# EAGLE schematic IC4KL_due_cont (EAGLE 9.6.1)
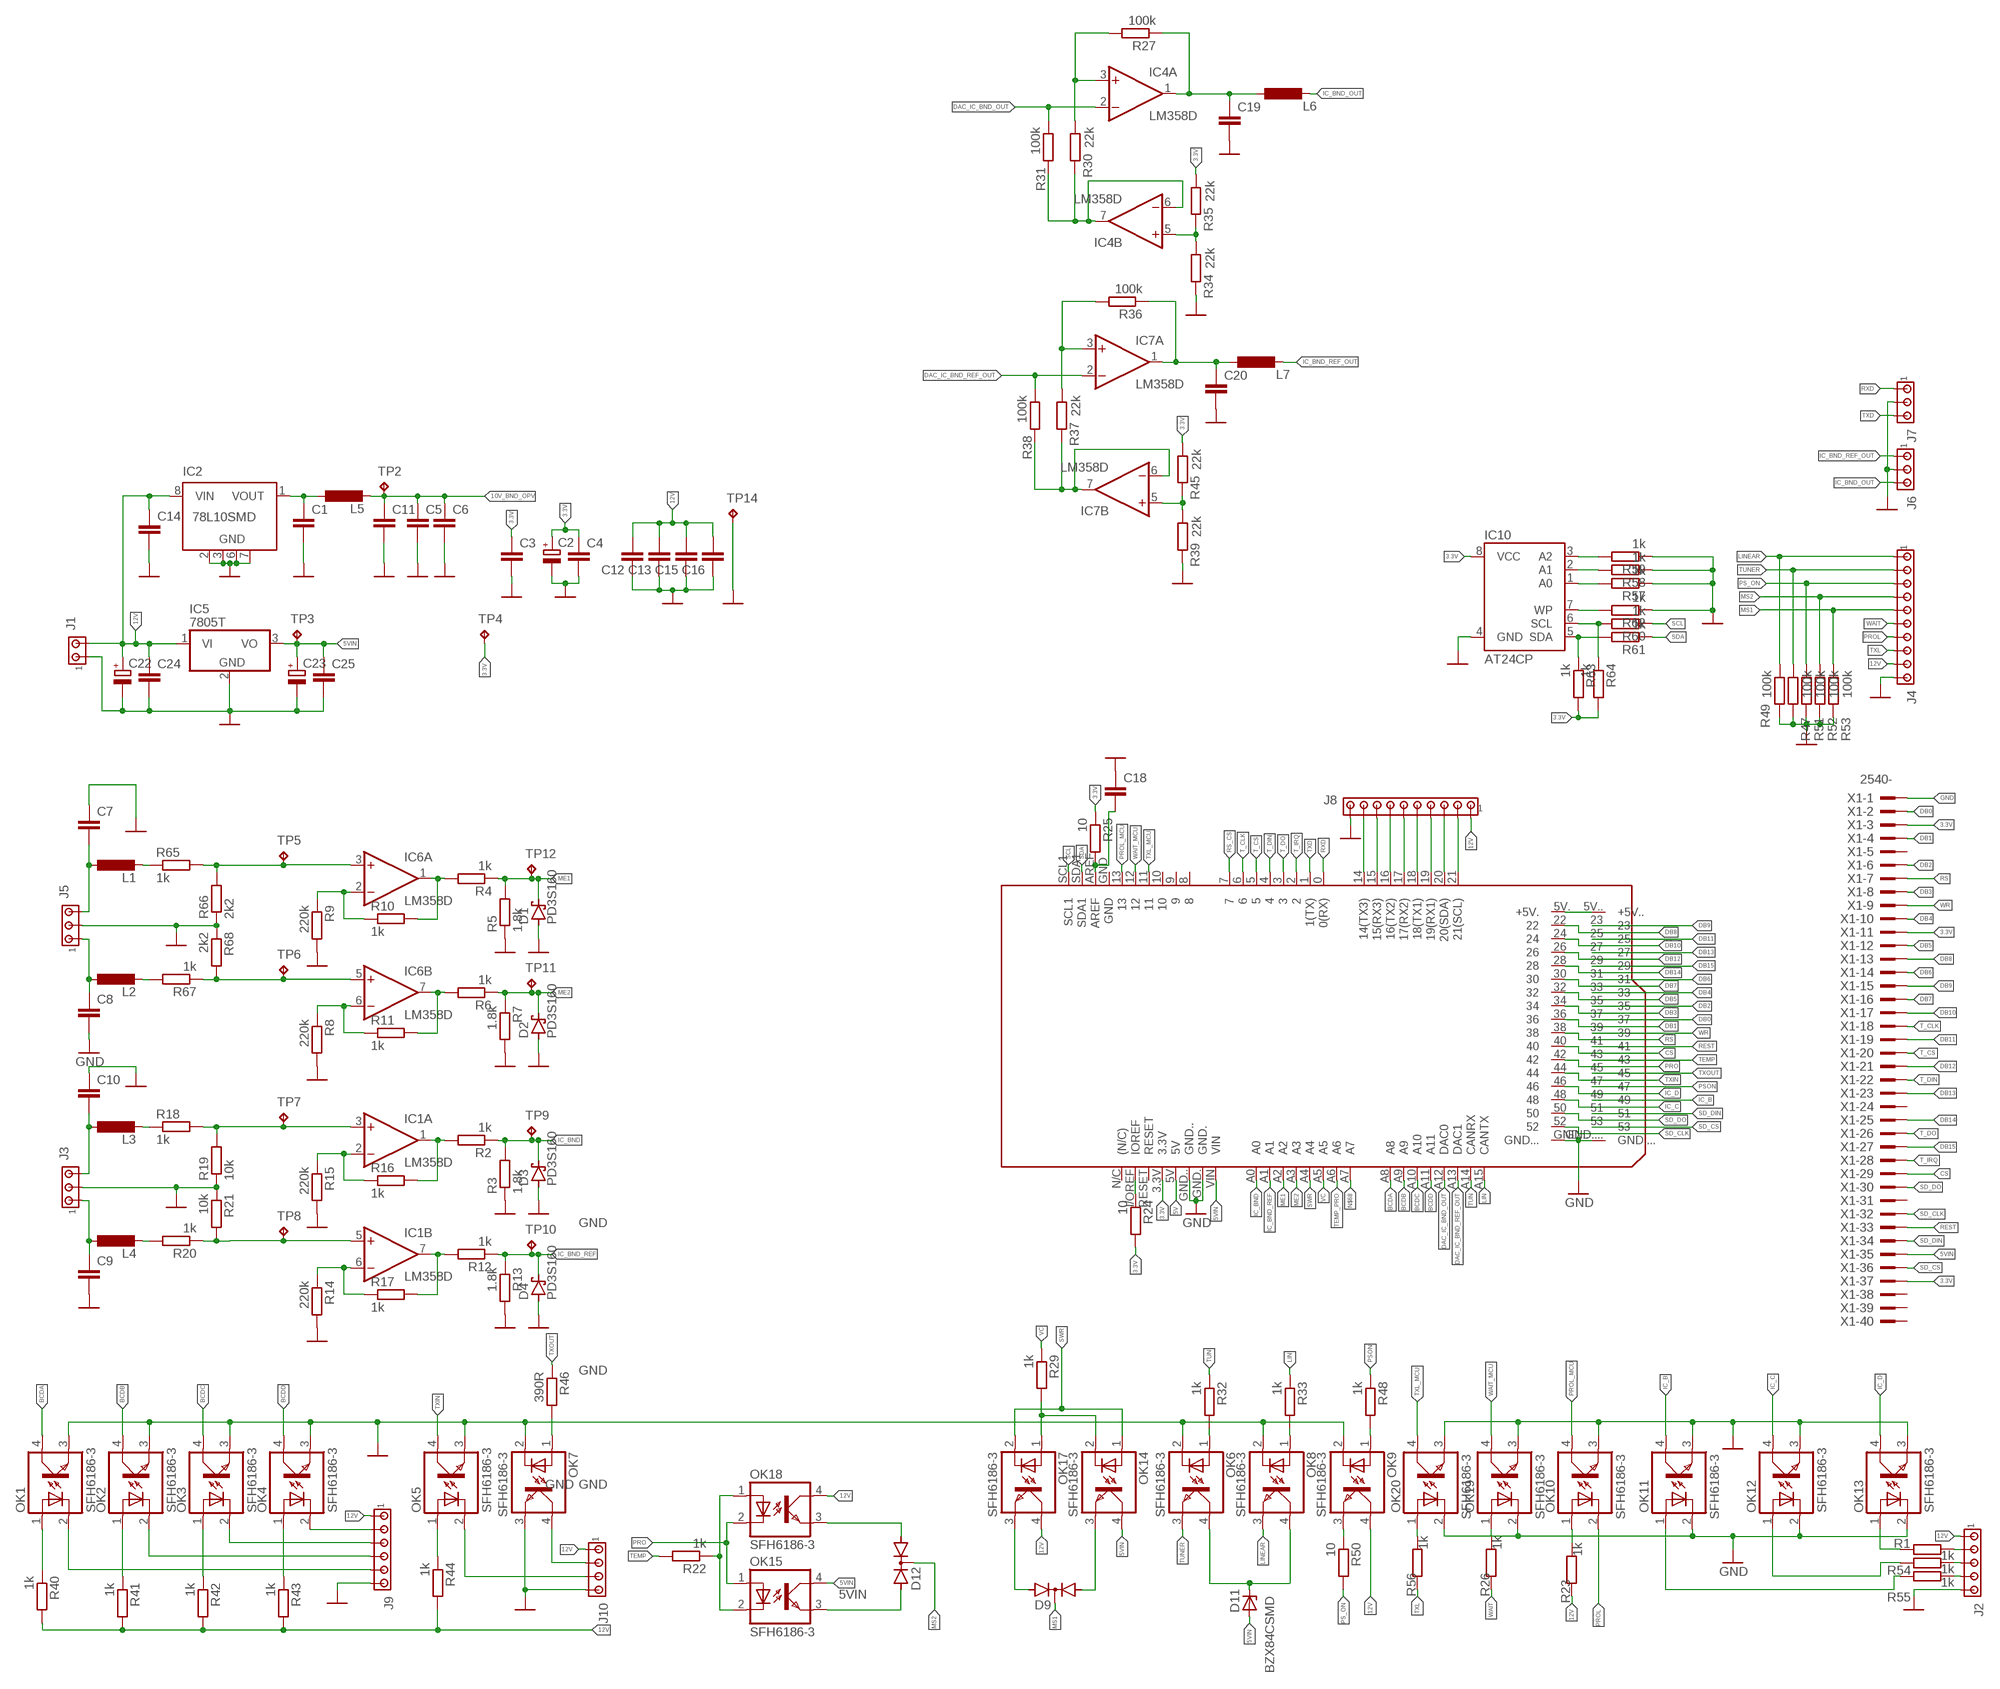
[diagram p0: schematic, sheet 1]

## Parts
C1  1u  C-EUC0805K  [C0805K]
C2  CPOL-EU085CS-1AW  [085CS_1AW]
C3  C-EUC0805K  [C0805K]
C4  C-EUC0805K  [C0805K]
C5  1u  C-EUC0805K  [C0805K]
C6  1u  C-EUC0805K  [C0805K]
C7  100n  C-EUC0805K  [C0805K]
C8  100n  C-EUC0805K  [C0805K]
C9  C-EUC0805K  [C0805K]
C10  C-EUC0805K  [C0805K]
C11  1u  C-EUC0805K  [C0805K]
C12  100n  C-EUC0805K  [C0805K]
C13  100n  C-EUC0805K  [C0805K]
C14  1u  C-EUC0805K  [C0805K]
C15  100n  C-EUC0805K  [C0805K]
C16  100n  C-EUC0805K  [C0805K]
C18  C-EUC0805K  [C0805K]
C19  C-EUC0805K  [C0805K]
C20  C-EUC0805K  [C0805K]
C22  CPOL-EU150CLZ-1010  [150CLZ-1010]
C23  CPOL-EU150CLZ-1010  [150CLZ-1010]
C24  C-EUC0805K  [C0805K]
C25  C-EUC0805K  [C0805K]
D1  PD3S160  [POWERDI323]
D2  PD3S160  [POWERDI323]
D3  PD3S160  [POWERDI323]
D4  PD3S160  [POWERDI323]
D9  DIODE-2AC|CASOT23  [SOT23]
D11  BZX84CSMD  [TO236]
D12  DIODE-2AC|CASOT23  [SOT23]
IC1  LM358D  [SO08]
IC2  78L10SMD  78L08SMD  [SO08]
IC4  LM358D  [SO08]
IC5  7805T  [TO220H]
IC6  LM358D  [SO08]
IC7  LM358D  [SO08]
IC10  AT24CP  [DIL08]
J1  MTA02-100  [10X02MTA]
J2  MTA05-100  [10X05MTA]
J3  MTA03-100  [10X03MTA]
J4  MTA10-100  [10X10MTA]
J5  MTA03-100  [10X03MTA]
J6  MTA03-100  [10X03MTA]
J7  MTA03-100  [10X03MTA]
J8  MTA10-100  [10X10MTA]
J9  MTA06-100  [10X06MTA]
J10  MTA04-100  [10X04MTA]
L1  L-EUL2012C  [L2012C]
L2  L-EUL2012C  [L2012C]
L3  L-EUL2012C  [L2012C]
L4  L-EUL2012C  [L2012C]
L5  L-EUL2012C  [L2012C]
L6  L-EUL2012C  [L2012C]
L7  L-EUL2012C  [L2012C]
OK1  SFH6186-3  [SMD4]
OK2  SFH6186-3  [SMD4]
OK3  SFH6186-3  [SMD4]
OK4  SFH6186-3  [SMD4]
OK5  SFH6186-3  [SMD4]
OK6  SFH6186-3  [SMD4]
OK7  SFH6186-3  [SMD4]
OK8  SFH6186-3  [SMD4]
OK9  SFH6186-3  [SMD4]
OK10  SFH6186-3  [SMD4]
OK11  SFH6186-3  [SMD4]
OK12  SFH6186-3  [SMD4]
OK13  SFH6186-3  [SMD4]
OK14  SFH6186-3  [SMD4]
OK15  SFH6186-3  [SMD4]
OK17  SFH6186-3  [SMD4]
OK18  SFH6186-3  [SMD4]
OK19  SFH6186-3  [SMD4]
OK20  SFH6186-3  [SMD4]
PCB1  ARDUINO_DUE  [ARDUINO_DUE]
R1  1k  R-EU_R0805  [R0805]
R2  1k  R-EU_R0805  [R0805]
R3  1.8k  R-EU_R0805  [R0805]
R4  1k  R-EU_R0805  [R0805]
R5  1.8k  R-EU_R0805  [R0805]
R6  1k  R-EU_R0805  [R0805]
R7  1.8k  R-EU_R0805  [R0805]
R8  220k  R-EU_R0805  [R0805]
R9  220k  R-EU_R0805  [R0805]
R10  1k  R-EU_R0805  [R0805]
R11  1k  R-EU_R0805  [R0805]
R12  1k  R-EU_R0805  [R0805]
R13  1.8k  R-EU_R0805  [R0805]
R14  220k  R-EU_R0805  [R0805]
R15  220k  R-EU_R0805  [R0805]
R16  1k  R-EU_R0805  [R0805]
R17  1k  R-EU_R0805  [R0805]
R18  1k  R-EU_R0805  [R0805]
R19  10k  R-EU_R0805  [R0805]
R20  1k  R-EU_R0805  [R0805]
R21  10k  R-EU_R0805  [R0805]
R22  1k  R-EU_R0805  [R0805]
R23  1k  R-EU_R0805  [R0805]
R24  10  R-EU_R0805  [R0805]
R25  10  R-EU_R0805  [R0805]
R26  1k  R-EU_R0805  [R0805]
R27  100k  R-EU_R0805  [R0805]
R29  1k  R-EU_R0805  [R0805]
R30  22k  R-EU_R0805  [R0805]
R31  100k  R-EU_R0805  [R0805]
R32  1k  R-EU_R0805  [R0805]
R33  1k  R-EU_R0805  [R0805]
R34  22k  R-EU_R0805  [R0805]
R35  22k  R-EU_R0805  [R0805]
R36  100k  R-EU_R0805  [R0805]
R37  22k  R-EU_R0805  [R0805]
R38  100k  R-EU_R0805  [R0805]
R39  22k  R-EU_R0805  [R0805]
R40  1k  R-EU_R0805  [R0805]
R41  1k  R-EU_R0805  [R0805]
R42  1k  R-EU_R0805  [R0805]
R43  1k  R-EU_R0805  [R0805]
R44  1k  R-EU_R0805  [R0805]
R45  22k  R-EU_R0805  [R0805]
R46  390R  R-EU_R0805  [R0805]
R47  100k  R-EU_R0805  [R0805]
R48  1k  R-EU_R0805  [R0805]
R49  100k  R-EU_R0805  [R0805]
R50  10  R-EU_R0805  [R0805]
R51  100k  R-EU_R0805  [R0805]
R52  100k  R-EU_R0805  [R0805]
R53  100k  R-EU_R0805  [R0805]
R54  1k  R-EU_R0805  [R0805]
R55  1k  R-EU_R0805  [R0805]
R56  1k  R-EU_R0805  [R0805]
R57  1k  R-EU_R0805  [R0805]
R58  1k  R-EU_R0805  [R0805]
R59  1k  R-EU_R0805  [R0805]
R60  1k  R-EU_R0805  [R0805]
R61  1k  R-EU_R0805  [R0805]
R62  1k  R-EU_R0805  [R0805]
R63  1k  R-EU_R0805  [R0805]
R64  1k  R-EU_R0805  [R0805]
R65  1k  R-EU_R0805  [R0805]
R66  2k2  R-EU_R0805  [R0805]
R67  1k  R-EU_R0805  [R0805]
R68  2k2  R-EU_R0805  [R0805]
TP2  TPB1,27  [B1,27]
TP3  TPB1,27  [B1,27]
TP4  TPB1,27  [B1,27]
TP5  TPB1,27  [B1,27]
TP6  TPB1,27  [B1,27]
TP7  TPB1,27  [B1,27]
TP8  TPB1,27  [B1,27]
TP9  TPB1,27  [B1,27]
TP10  TPB1,27  [B1,27]
TP11  TPB1,27  [B1,27]
TP12  TPB1,27  [B1,27]
TP14  TPB1,27  [B1,27]
X1  2540-  [PAK100/2500-40]

## Nets
3.3V: C2.+ C3.1 C4.1 IC10.8(VCC) PCB1.3.3V R24.2 R25.1 R35.1 R45.1 R63.2 R64.2 TP4.TP X1.3 X1.11 X1.37
5V: PCB1.5V
5VIN: C23.+ C25.1 D11.A IC5.3(VO) OK14.4(COL) OK15.4(COL) PCB1.VIN TP3.TP X1.35
10V_BND_OPV: C5.1 C6.1 C11.1 L5.2 TP2.TP
12V: C12.2 C13.2 C14.1 C15.2 C16.2 C22.+ C24.1 IC2.8(VIN) IC5.1(VI) J1.2 J2.1 J4.9 J8.1 J9.6 J10.1 OK9.4(COL) OK17.4(COL) OK18.4(COL) R23.1 R40.2 R41.2 R42.2 R43.2 R44.2
BCDA: OK1.4(COL) PCB1.A8
BCDB: OK2.4(COL) PCB1.A9
BCDC: OK3.4(COL) PCB1.A10
BCDD: OK4.4(COL) PCB1.A11
CS: PCB1.40 X1.29
DAC_IC_BND_OUT: IC4.2(A:-IN) PCB1.A12(DAC0) R31.1
DAC_IC_BND_REF_OUT: IC7.2(A:-IN) PCB1.A13(DAC1) R38.1
DB0: PCB1.37 X1.2
DB1: PCB1.36 X1.4
DB2: PCB1.35 X1.6
DB3: PCB1.34 X1.8
DB4: PCB1.33 X1.10
DB5: PCB1.32 X1.12
DB6: PCB1.31 X1.14
DB7: PCB1.30 X1.16
DB8: PCB1.22 X1.13
DB9: PCB1.23 X1.15
DB10: PCB1.24 X1.17
DB11: PCB1.25 X1.19
DB12: PCB1.26 X1.21
DB13: PCB1.27 X1.23
DB14: PCB1.28 X1.25
DB15: PCB1.29 X1.27
GND: C1.2 C2.- C3.2 C4.2 C5.2 C6.2 C7.1 C8.2 C9.2 C10.1 C11.2 C12.1 C13.1 C14.2 C15.1 C16.1 C18.1 C19.2 C20.2 C22.- C23.- C24.2 C25.2 D1.A D2.A D3.A D4.A IC2.2(GND) IC2.3(GND) IC2.6(GND) IC2.7(GND) IC5.2(GND) IC10.4(GND) J1.1 J2.5 J3.2 J4.10 J5.2 J6.2 J7.2 J8.10 J9.1 J10.4 OK1.3(EMIT) OK2.3(EMIT) OK3.3(EMIT) OK4.3(EMIT) OK5.3(EMIT) OK6.2(C) OK7.2(C) OK7.3(EMIT) OK8.2(C) OK9.2(C) OK10.3(EMIT) OK11.2(C) OK11.3(EMIT) OK12.2(C) OK12.3(EMIT) OK13.2(C) OK13.3(EMIT) OK19.2(C) OK19.3(EMIT) OK20.2(C) OK20.3(EMIT) PCB1.GND. PCB1.GND.. PCB1.GND... PCB1.GND.... R3.1 R5.1 R7.2 R8.2 R9.2 R13.2 R14.2 R15.2 R19.1 R21.1 R34.2 R39.2 R47.2 R49.2 R51.2 R52.2 R53.2 R57.1 R58.1 R59.1 R62.1 R66.1 R68.1 TP14.TP X1.1
IC_B: OK11.4(COL) PCB1.49
IC_BND: D3.C PCB1.A0 R2.1 R3.2 TP9.TP
IC_BND_IN: C10.2 J3.3 L3.1
IC_BND_OUT: J6.3 L6.2
IC_BND_REF: D4.C PCB1.A1 R12.1 R13.1 TP10.TP
IC_BND_REF_IN: C9.1 J3.1 L4.1
IC_BND_REF_OUT: J6.1 L7.2
IC_C: OK12.4(COL) PCB1.48
IC_D: OK13.4(COL) PCB1.46
LIN: PCB1.A15(CANTX) R33.1
LINEAR: J4.1 OK8.3(EMIT) R49.1
M1: C7.2 J5.3 L1.1
M2: C8.1 J5.1 L2.1
ME1: D1.C PCB1.A2 R4.1 R5.2 TP12.TP
ME2: D2.C PCB1.A3 R6.1 R7.1 TP11.TP
MS1: D9.3(C) J4.5 R53.1
MS2: D12.3(C) J4.4 R52.1
N$1: L2.2 R67.2
N$2: IC6.1(A:OUT) R4.2 R10.2
N$3: OK1.1(A) R40.1
N$4: L1.2 R65.1
N$5: IC6.7(B:OUT) R6.2 R11.2
N$6: IC6.6(B:-IN) R8.1 R11.1
N$8: IC6.2(A:-IN) R9.1 R10.1
N$9: OK13.1(A) R1.1
N$10: J2.2 R1.2
N$13: IC1.1(A:OUT) R2.2 R16.2
N$14: IC1.7(B:OUT) R12.2 R17.2
N$15: IC1.6(B:-IN) R14.1 R17.1
N$16: IC1.2(A:-IN) R15.1 R16.1
N$19: IC7.3(A:+IN) R36.2 R37.1
N$20: IC1.3(A:+IN) R18.2 R19.2 TP7.TP
N$21: L4.2 R20.2
N$22: L3.2 R18.1
N$24: D12.1(A1) OK18.3(EMIT)
N$25: IC6.3(A:+IN) R65.2 R66.2 TP5.TP
N$26: IC6.5(B:+IN) R67.1 R68.2 TP6.TP
N$30: C1.1 IC2.1(VOUT) L5.1
N$31: PCB1.5V.(+5V.) PCB1.5V..(+5V..)
N$32: OK6.1(A) R32.2
N$33: OK8.1(A) R33.2
N$34: D11.C OK6.4(COL) OK8.4(COL)
N$35: IC4.3(A:+IN) R27.2 R30.1
N$36: OK15.2(C) OK18.1(A) R22.1
N$39: IC1.5(B:+IN) R20.1 R21.2 TP8.TP
N$40: C19.1 IC4.1(A:OUT) L6.1 R27.1
N$41: D12.2(A2) OK15.3(EMIT)
N$42: IC4.6(B:-IN) IC4.7(B:OUT) R30.2 R31.2
N$43: D9.2(A2) OK17.3(EMIT)
N$44: D9.1(A1) OK14.3(EMIT)
N$45: IC7.6(B:-IN) IC7.7(B:OUT) R37.2 R38.2
N$46: IC4.5(B:+IN) R34.1 R35.2
N$47: OK2.1(A) R41.1
N$48: OK10.1(A) R23.2
N$49: OK3.1(A) R42.1
N$52: OK14.2(C) OK17.1(A) R29.2
N$53: OK4.1(A) R43.1
N$55: PCB1.I/OREF(IOREF) R24.1
N$56: C18.2 PCB1.AREF R25.2
N$57: OK19.1(A) R26.2
N$64: OK7.1(A) R46.2
N$65: IC7.5(B:+IN) R39.1 R45.2
N$66: OK20.1(A) R56.2
N$68: PCB1.A7
N$70: C20.1 IC7.1(A:OUT) L7.1 R36.1
N$72: J8.8 PCB1.15(15(RX3))
N$73: OK5.1(A) R44.1
N$74: J10.3 OK5.2(C)
N$75: J8.7 PCB1.16(16(TX2))
N$76: J8.6 PCB1.17(17(RX2))
N$77: J8.5 PCB1.18(18(TX1))
N$78: J10.2 OK7.4(COL)
N$79: J8.4 PCB1.19(19(RX1))
N$81: J8.3 PCB1.20(20(SDA))
N$82: J8.2 PCB1.21(21(SCL))
N$83: J8.9 PCB1.14(14(TX3))
N$85: OK9.3(EMIT) R50.1
N$88: J2.3 R54.2
N$89: OK9.1(A) R48.2
N$91: J2.4 R55.2
N$92: OK12.1(A) R54.1
N$93: OK11.1(A) R55.1
N$97: IC10.3(A2) R59.2
N$98: IC10.2(A1) R58.2
N$99: IC10.1(A0) R57.2
N$100: IC10.7(WP) R62.2
N$102: IC10.5(SDA) R61.2 R63.1
N$104: IC10.6(SCL) R60.2 R64.1
PRO: OK15.1(A) OK18.2(C) PCB1.42
PROL: J4.7 OK10.2(C)
PROL_MCU: OK10.4(COL) PCB1.13
PS_ON: J4.3 R50.2 R51.1
PSON: PCB1.47 R48.1
REST: PCB1.41 X1.33
RS: PCB1.38 X1.7
RS_CS: PCB1.7
RXD: J7.1 PCB1.0(0(RX))
SCL: PCB1.SCL1 R60.1
SD_CLK: PCB1.52 X1.32
SD_CS: PCB1.53 X1.36
SD_DIN: PCB1.51 X1.34
SD_DO: PCB1.50 X1.30
SDA: PCB1.SDA1 R61.1
SWR: OK14.1(A) OK17.2(C) PCB1.A4
T_CLK: PCB1.6 X1.18
T_CS: PCB1.5 X1.20
T_DIN: PCB1.4 X1.22
T_DO: PCB1.3 X1.26
T_IRQ: PCB1.2 X1.28
TEMP: PCB1.43 R22.2
TEMP_PRO: PCB1.A6
TUN: PCB1.A14(CANRX) R32.1
TUNER: J4.2 OK6.3(EMIT) R47.1
TXD: J7.3 PCB1.1(1(TX))
TXIN: OK5.4(COL) PCB1.44
TXL: J4.8 R56.1
TXL_MCU: OK20.4(COL) PCB1.11
TXOUT: PCB1.45 R46.1
VC: PCB1.A5 R29.1
WAIT: J4.6 R26.1
WAIT_MCU: OK19.4(COL) PCB1.12
WR: PCB1.39 X1.9
Y_A: J9.2 OK1.2(C)
Y_B: J9.3 OK2.2(C)
Y_C: J9.4 OK3.2(C)
Y_D: J9.5 OK4.2(C)
Unconnected: IC2.4(NC) IC2.5(NC) PCB1.8 PCB1.9 PCB1.10 PCB1.GND PCB1.N/C((N/C)) PCB1.RESET X1.5 X1.24 X1.31 X1.38 X1.39 X1.40

## Power pins joined to a net without a drawn wire
V+: IC1.8(P:V+) IC4.8(P:V+) IC6.8(P:V+) IC7.8(P:V+)
V-: IC1.4(P:V-) IC4.4(P:V-) IC6.4(P:V-) IC7.4(P:V-)

## Library data of the parts
C1 C3-C16 C18-C20 C24 C25 = rcl:C-EU: CAPACITOR, European symbol
C2 C22 C23 = rcl:CPOL-EU: POLARIZED CAPACITOR, European symbol
D1-D4 = diode:PD3S160: 1.0A SURFACE MOUNT SCHOTTKY BARRIER RECTIFIER POWERDI ® 323 Source: http://www.diodes.com/datasheets/ds30899.pdf
D9 D12 = diode:DIODE-2AC|CA: Dual DIODE Anode-Cathode|Cathode-Anode
D11 = diode:BZX84CSMD: Z DIODE
IC1 IC4 IC6 IC7 = linear:LM358: OP AMP also LM158; LM258; LM2904 Source: http://cache.national.com/ds/LM/LM158.pdf
IC2 = linear:78L*SMD: Positive VOLTAGE REGULATOR
IC5 = linear:78*: Positive VOLTAGE REGULATOR Source: http://cache.national.com/ds/LM/LM78L05.pdf http://www.fairchildsemi.com/ds/LM/LM7805.pdf
IC10 = atmel:AT24C*: 2-wire serial EEPROM; MPN: AT24C1024BW-SH-B; OC_FARNELL: 1362646; OC_NEWARK: 03P2044
J1 = con-amp:MTA02-100: AMP connector; OC_FARNELL: unknown; OC_NEWARK: unknown
J2 = con-amp:MTA05-100: AMP connector; OC_FARNELL: unknown; OC_NEWARK: unknown
J3 J5-J7 = con-amp:MTA03-100: AMP connector; OC_FARNELL: unknown; OC_NEWARK: unknown
J4 J8 = con-amp:MTA10-100: AMP connector
J9 = con-amp:MTA06-100: AMP connector; OC_FARNELL: unknown; OC_NEWARK: unknown
J10 = con-amp:MTA04-100: AMP connector; OC_FARNELL: unknown; OC_NEWARK: unknown
L1-L7 = rcl:L-EU: INDUCTOR, European symbol
OK1-OK15 OK17-OK20 = optocoupler:SFH618?*: Optocoupler, Phototransistor Output, Low Input Current Source: http://www.vishay.com/docs/83673/sfh618.pdf; MF: VISHAY/TELEFUNKEN; MPN: SFH6186-3; OC_FARNELL: 1469529; OC_NEWARK: 21H7751
PCB1 = Arduino_revC:ARDUINO_DUE: Device for representing an Arduino Due board with a footprint in an EAGLE design. Created by Dave Young for Element14. More EAGLE documentation at: http://www.element14.com/community/community/knode/cadsoft_eagle
R1-R27 R29-R68 = rcl:R-EU_: RESISTOR, European symbol
TP2-TP12 TP14 = testpad:TP: Test pad
X1 = con-3m:2540-: 3M (TM) Pak 100 4-Wall Header Source: 3M; OC_FARNELL: unknown; OC_NEWARK: unknown